# EAGLE schematic Schaltplan final (EAGLE 9.7.0)
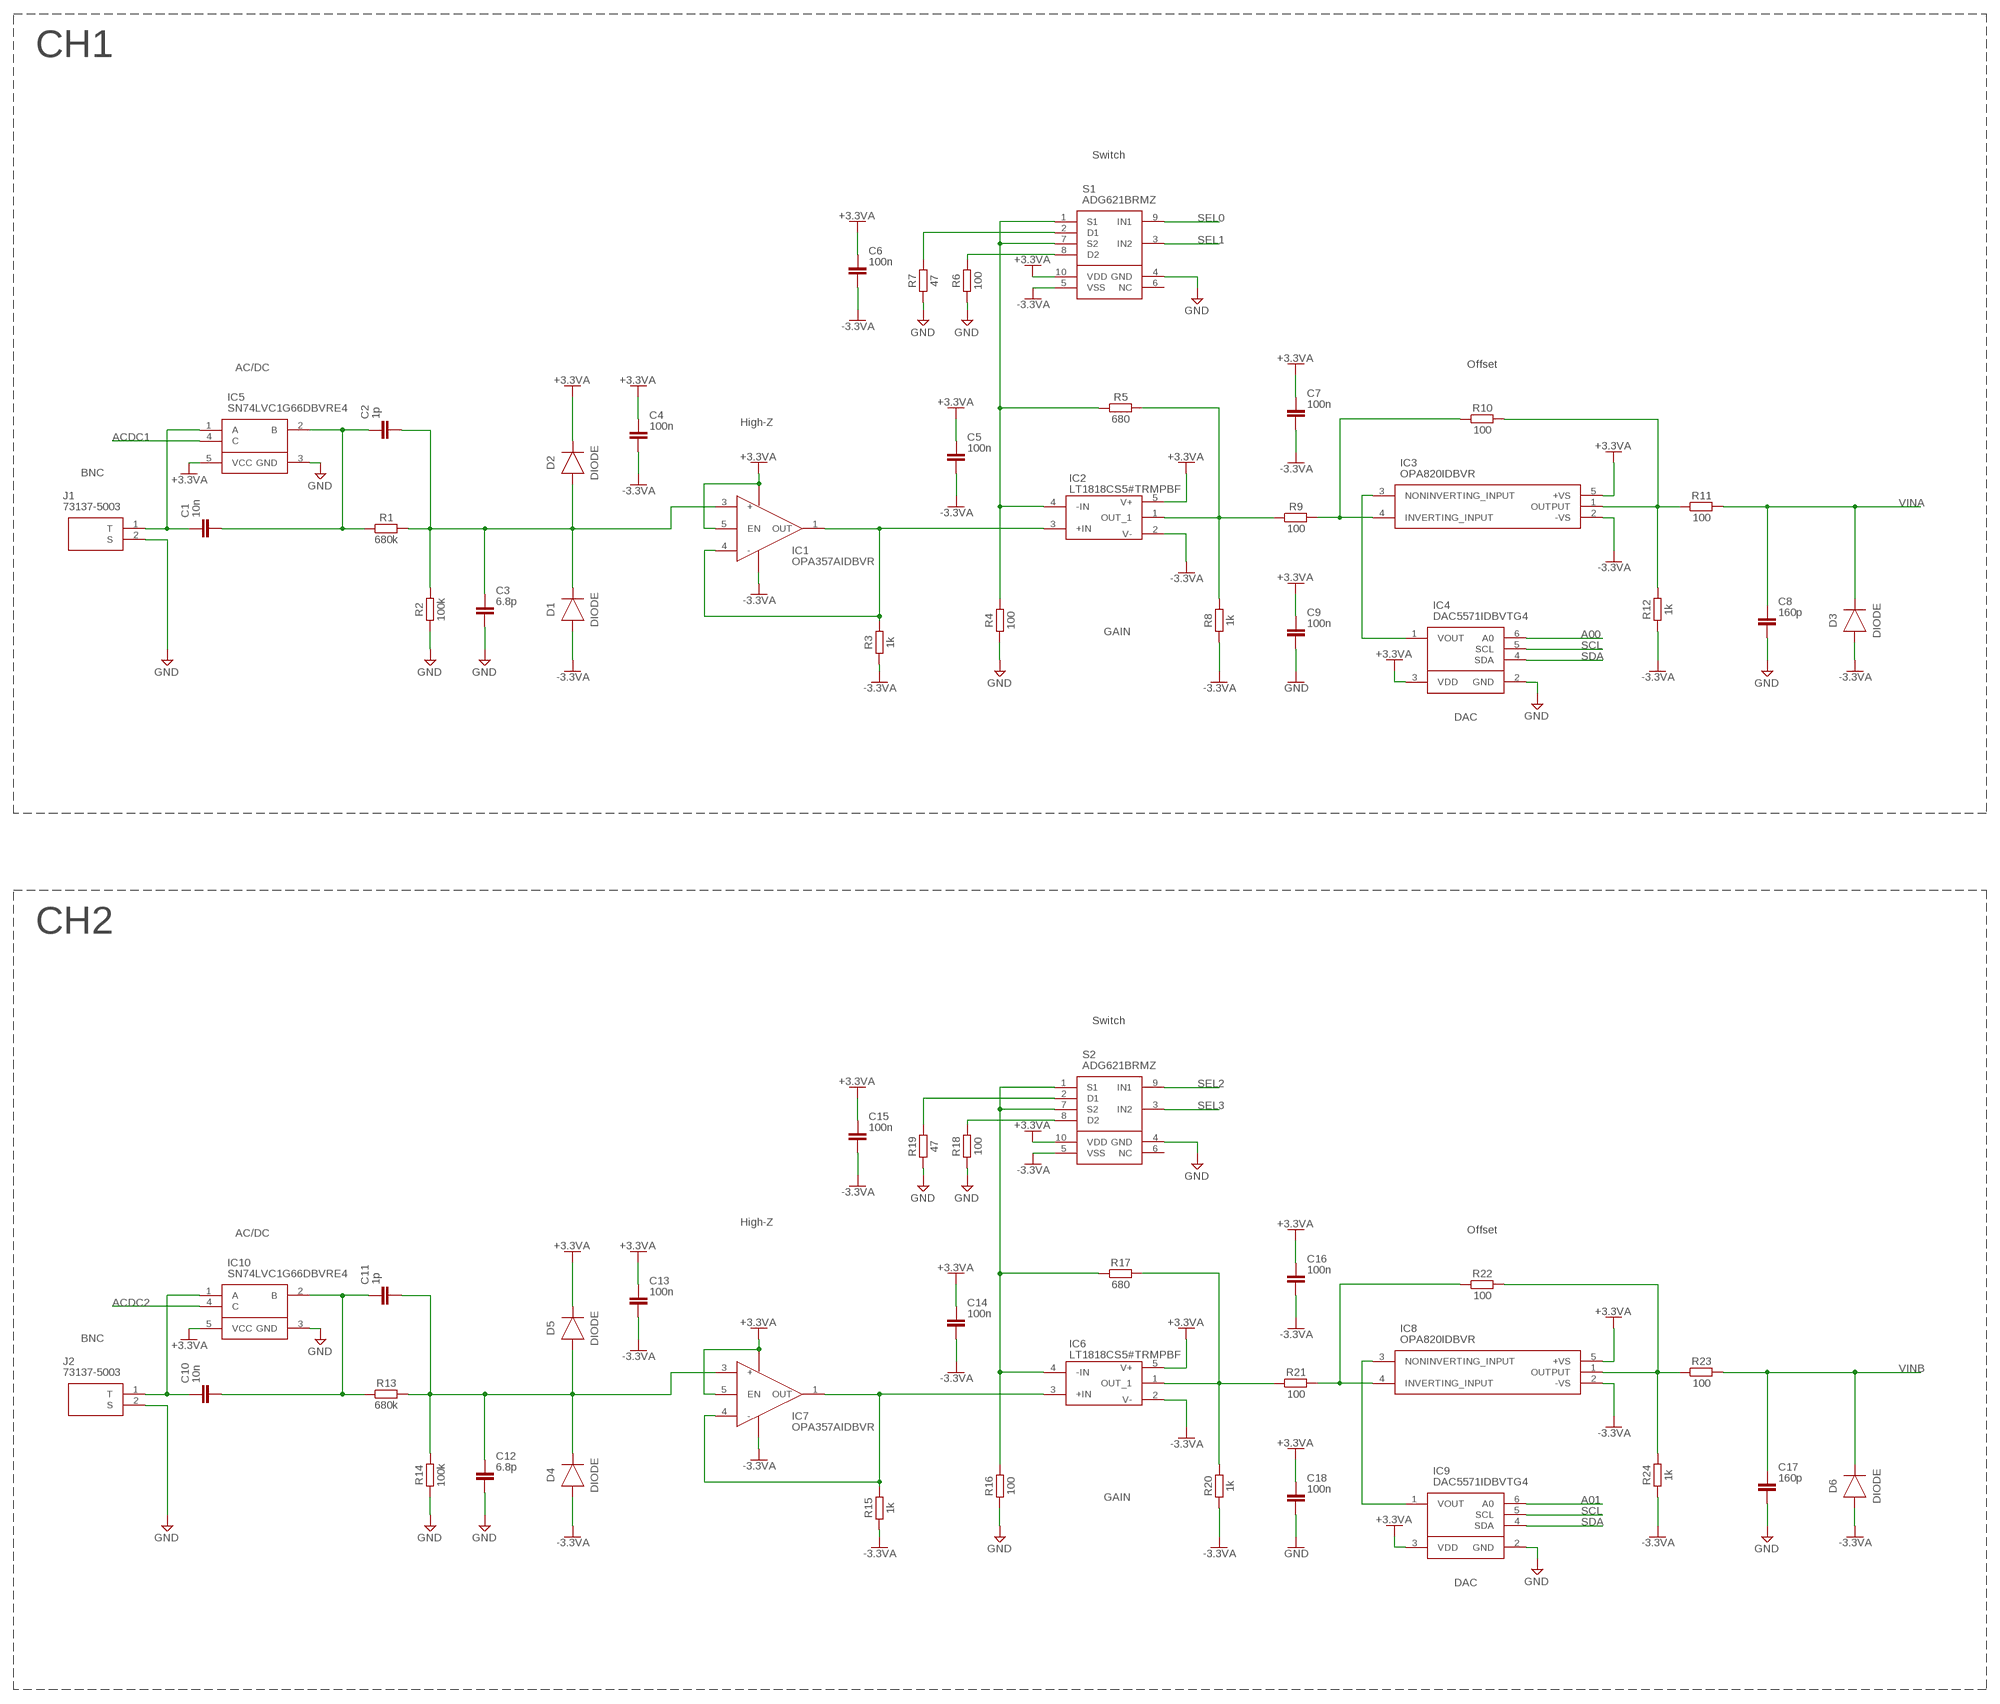
[diagram p0: schematic, sheet 1, part 1 of 2]
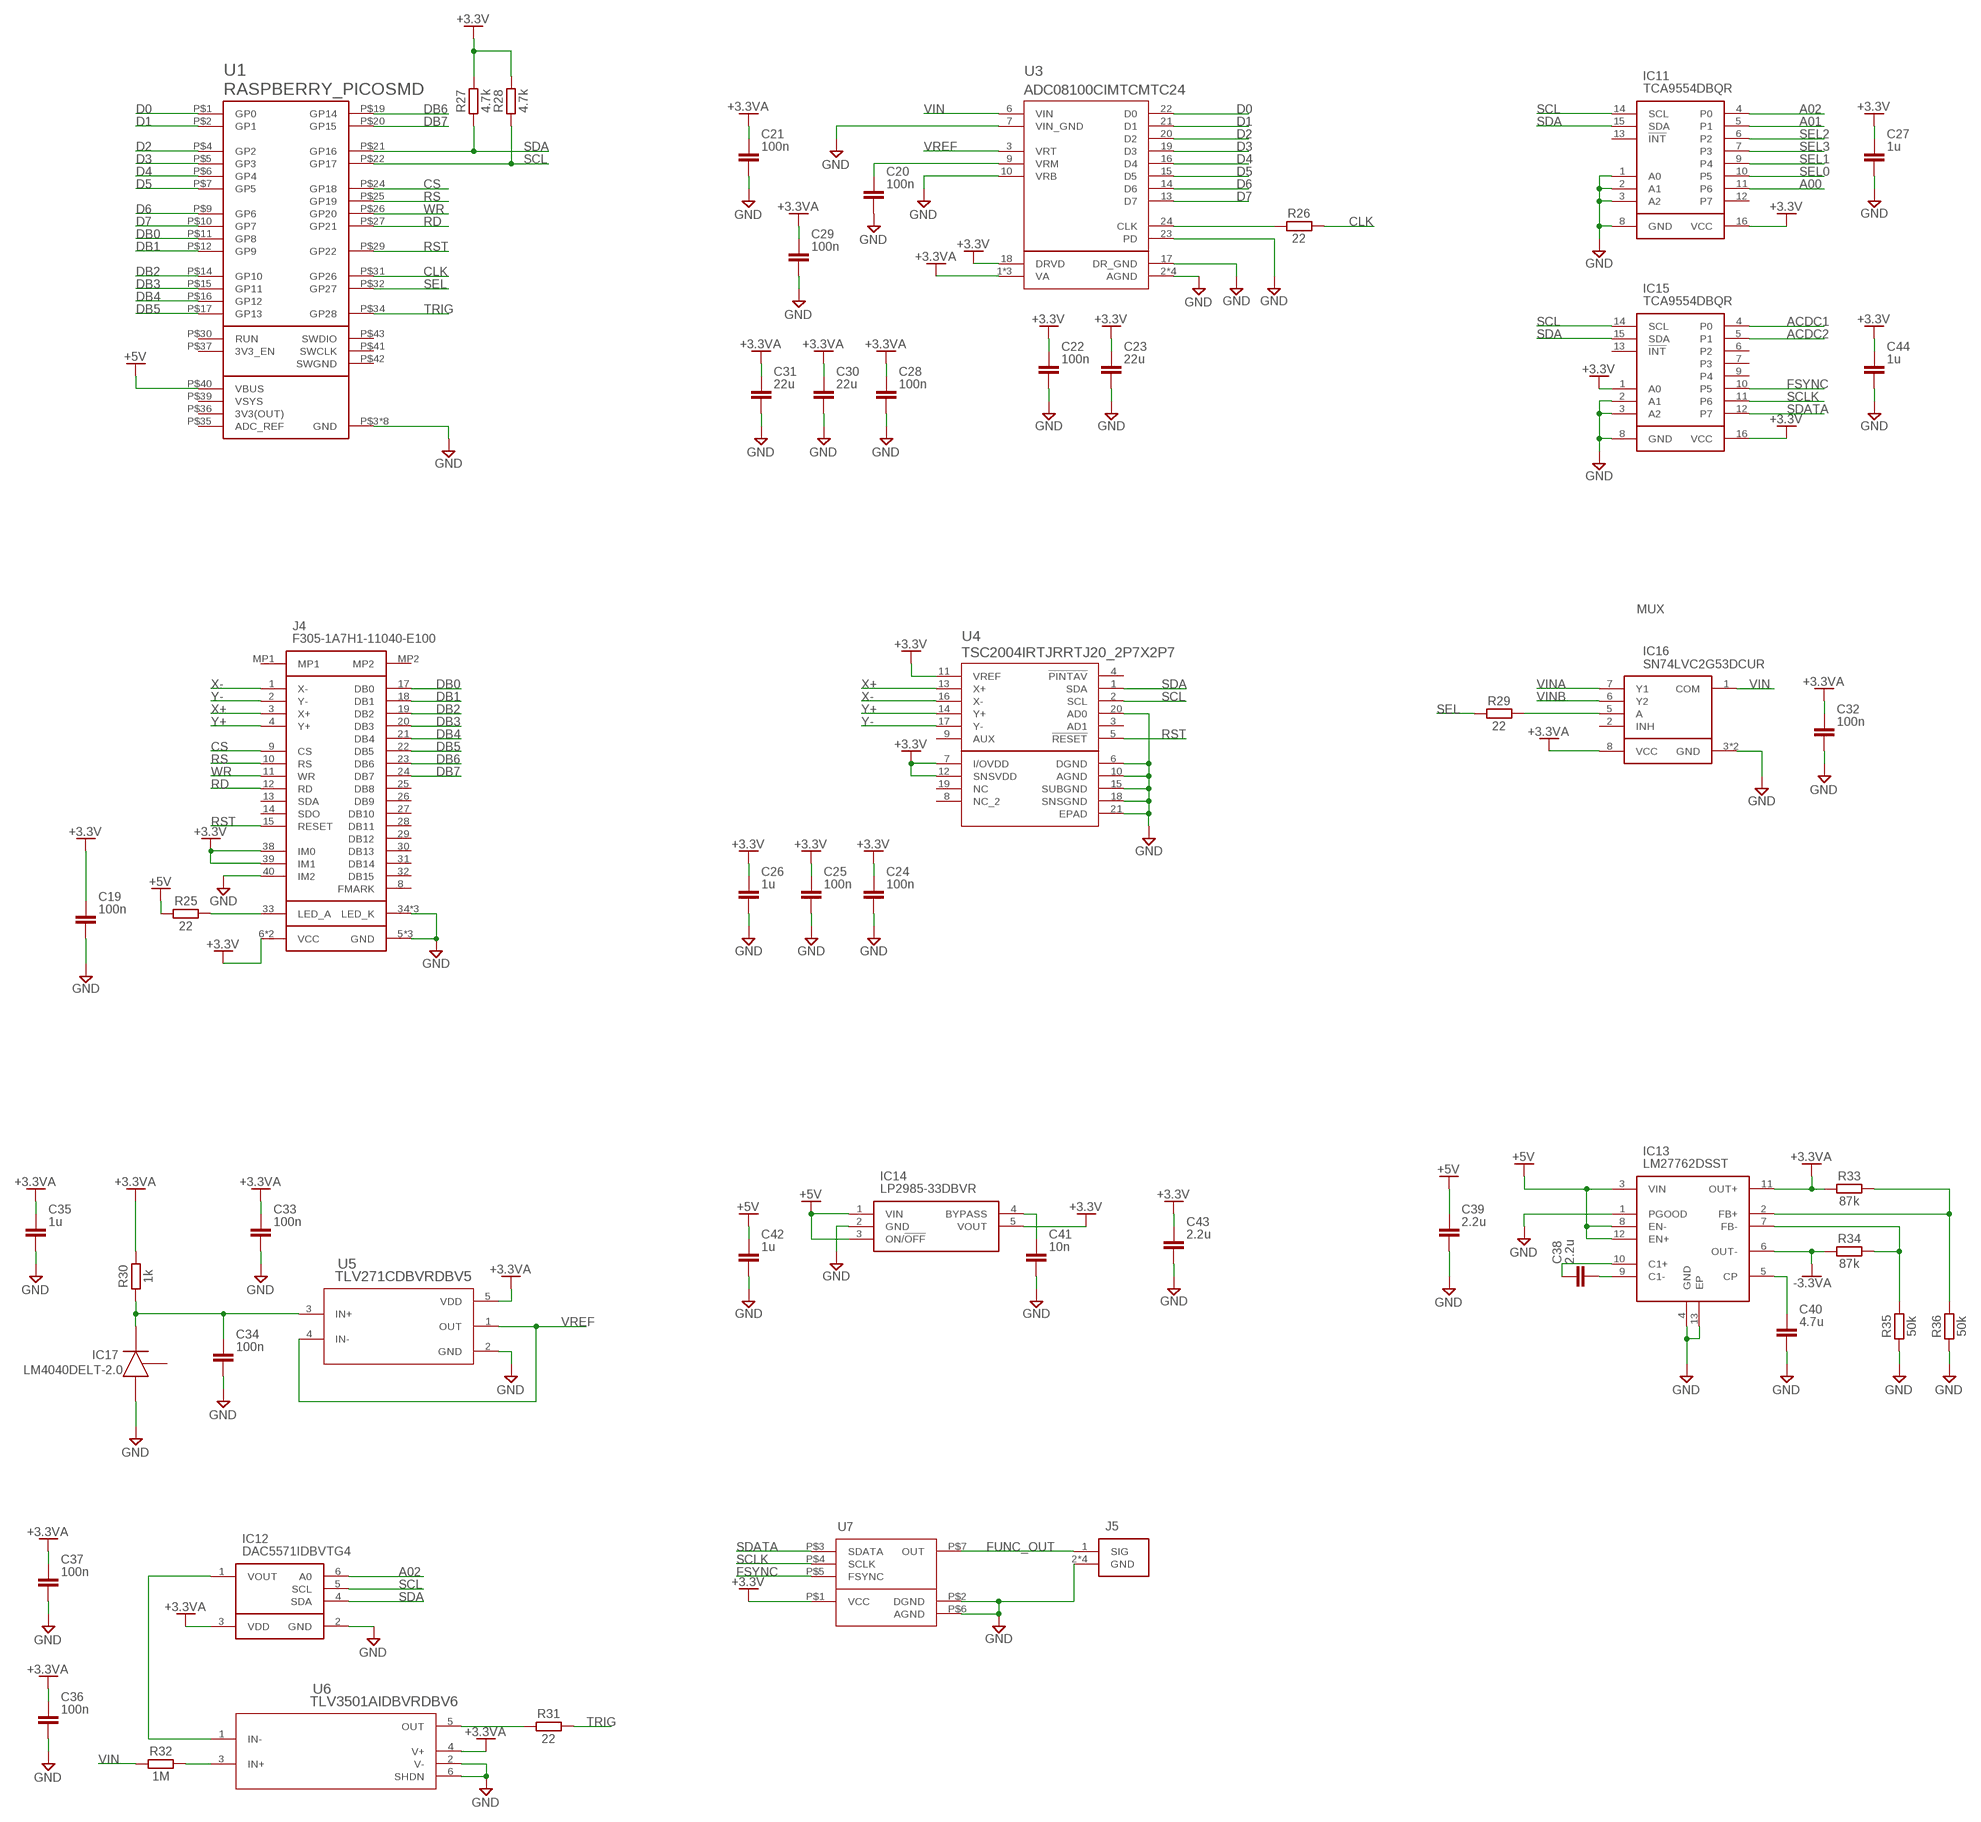
[diagram p1: schematic, sheet 1, part 2 of 2]

## Parts
C1  10n  C_CHIP-0805(2012-METRIC)  [CAPC2012X110]
C2  1p  C_CHIP-0805(2012-METRIC)  [CAPC2012X110]
C3  6.8p  C_CHIP-0805(2012-METRIC)  [CAPC2012X110]
C4  100n  C_CHIP-0805(2012-METRIC)  [CAPC2012X110]
C5  100n  C_CHIP-0805(2012-METRIC)  [CAPC2012X110]
C6  100n  C_CHIP-0805(2012-METRIC)  [CAPC2012X110]
C7  100n  C_CHIP-0805(2012-METRIC)  [CAPC2012X110]
C8  160p  C_CHIP-0805(2012-METRIC)  [CAPC2012X110]
C9  100n  C_CHIP-0805(2012-METRIC)  [CAPC2012X110]
C10  10n  C_CHIP-0805(2012-METRIC)  [CAPC2012X110]
C11  1p  C_CHIP-0805(2012-METRIC)  [CAPC2012X110]
C12  6.8p  C_CHIP-0805(2012-METRIC)  [CAPC2012X110]
C13  100n  C_CHIP-0805(2012-METRIC)  [CAPC2012X110]
C14  100n  C_CHIP-0805(2012-METRIC)  [CAPC2012X110]
C15  100n  C_CHIP-0805(2012-METRIC)  [CAPC2012X110]
C16  100n  C_CHIP-0805(2012-METRIC)  [CAPC2012X110]
C17  160p  C_CHIP-0805(2012-METRIC)  [CAPC2012X110]
C18  100n  C_CHIP-0805(2012-METRIC)  [CAPC2012X110]
C19  100n  C_CHIP-0805(2012-METRIC)  [CAPC2012X110]
C20  100n  C_CHIP-0805(2012-METRIC)  [CAPC2012X110]
C21  100n  C_CHIP-0805(2012-METRIC)  [CAPC2012X110]
C22  100n  C_CHIP-0805(2012-METRIC)  [CAPC2012X110]
C23  22u  C_CHIP-0805(2012-METRIC)  [CAPC2012X110]
C24  100n  C_CHIP-0805(2012-METRIC)  [CAPC2012X110]
C25  100n  C_CHIP-0805(2012-METRIC)  [CAPC2012X110]
C26  1u  C_CHIP-0805(2012-METRIC)  [CAPC2012X110]
C27  1u  C_CHIP-0805(2012-METRIC)  [CAPC2012X110]
C28  100n  C_CHIP-0805(2012-METRIC)  [CAPC2012X110]
C29  100n  C_CHIP-0805(2012-METRIC)  [CAPC2012X110]
C30  22u  C_CHIP-0805(2012-METRIC)  [CAPC2012X110]
C31  22u  C_CHIP-0805(2012-METRIC)  [CAPC2012X110]
C32  100n  C_CHIP-0805(2012-METRIC)  [CAPC2012X110]
C33  100n  C_CHIP-0805(2012-METRIC)  [CAPC2012X110]
C34  100n  C_CHIP-0805(2012-METRIC)  [CAPC2012X110]
C35  1u  C_CHIP-0805(2012-METRIC)  [CAPC2012X110]
C36  100n  C_CHIP-0805(2012-METRIC)  [CAPC2012X110]
C37  100n  C_CHIP-0805(2012-METRIC)  [CAPC2012X110]
C38  2.2u  C_CHIP-0805(2012-METRIC)  [CAPC2012X110]
C39  2.2u  C_CHIP-0805(2012-METRIC)  [CAPC2012X110]
C40  4.7u  C_CHIP-0805(2012-METRIC)  [CAPC2012X110]
C41  10n  C_CHIP-0805(2012-METRIC)  [CAPC2012X110]
C42  1u  C_CHIP-0805(2012-METRIC)  [CAPC2012X110]
C43  2.2u  C_CHIP-0805(2012-METRIC)  [CAPC2012X110]
C44  1u  C_CHIP-0805(2012-METRIC)  [CAPC2012X110]
D1  DIODE  DIODE_DO-219-AC(SOD323F)  [SODFL2513X70]
D2  DIODE  DIODE_DO-219-AC(SOD323F)  [SODFL2513X70]
D3  DIODE  DIODE_DO-219-AC(SOD323F)  [SODFL2513X70]
D4  DIODE  DIODE_DO-219-AC(SOD323F)  [SODFL2513X70]
D5  DIODE  DIODE_DO-219-AC(SOD323F)  [SODFL2513X70]
D6  DIODE  DIODE_DO-219-AC(SOD323F)  [SODFL2513X70]
IC1  OPA357AIDBVR  [SOT95P280X145-6N]
IC2  LT1818CS5#TRMPBF  [SOT95P280X100-5N]
IC3  OPA820IDBVR  [SOT95P280X145-5N]
IC4  DAC5571IDBVTG4  [SOT95P280X145-6N]
IC5  SN74LVC1G66DBVRE4  [SOT95P280X145-5N]
IC6  LT1818CS5#TRMPBF  [SOT95P280X100-5N]
IC7  OPA357AIDBVR  [SOT95P280X145-6N]
IC8  OPA820IDBVR  [SOT95P280X145-5N]
IC9  DAC5571IDBVTG4  [SOT95P280X145-6N]
IC10  SN74LVC1G66DBVRE4  [SOT95P280X145-5N]
IC11  TCA9554DBQR  [SOP64P600X175-16N]
IC12  DAC5571IDBVTG4  [SOT95P280X145-6N]
IC13  LM27762DSST  [SON50P200X300X80-13N]
IC14  LP2985-33DBVR  [SOT95P280X145-5N]
IC15  TCA9554DBQR  [SOP64P600X175-16N]
IC16  SN74LVC2G53DCUR  [SOP50P310X90-8N]
IC17  LM4040DELT-2.0  [SOT65P210X110-3N]
J1  73137-5003  [731375003]
J2  73137-5003  [731375003]
J4  F305-1A7H1-11040-E100  [F3051A7H111040E100]
J5  PCB.SMAFRA.HT  [PCBSMAFRAHT]
R1  680k  R_CHIP-0805(2012-METRIC)  [RESC2012X65]
R2  100k  R_CHIP-0805(2012-METRIC)  [RESC2012X65]
R3  1k  R_CHIP-0805(2012-METRIC)  [RESC2012X65]
R4  100  R_CHIP-0805(2012-METRIC)  [RESC2012X65]
R5  680  R_CHIP-0805(2012-METRIC)  [RESC2012X65]
R6  100  R_CHIP-0805(2012-METRIC)  [RESC2012X65]
R7  47  R_CHIP-0805(2012-METRIC)  [RESC2012X65]
R8  1k  R_CHIP-0805(2012-METRIC)  [RESC2012X65]
R9  100  R_CHIP-0805(2012-METRIC)  [RESC2012X65]
R10  100  R_CHIP-0805(2012-METRIC)  [RESC2012X65]
R11  100  R_CHIP-0805(2012-METRIC)  [RESC2012X65]
R12  1k  R_CHIP-0805(2012-METRIC)  [RESC2012X65]
R13  680k  R_CHIP-0805(2012-METRIC)  [RESC2012X65]
R14  100k  R_CHIP-0805(2012-METRIC)  [RESC2012X65]
R15  1k  R_CHIP-0805(2012-METRIC)  [RESC2012X65]
R16  100  R_CHIP-0805(2012-METRIC)  [RESC2012X65]
R17  680  R_CHIP-0805(2012-METRIC)  [RESC2012X65]
R18  100  R_CHIP-0805(2012-METRIC)  [RESC2012X65]
R19  47  R_CHIP-0805(2012-METRIC)  [RESC2012X65]
R20  1k  R_CHIP-0805(2012-METRIC)  [RESC2012X65]
R21  100  R_CHIP-0805(2012-METRIC)  [RESC2012X65]
R22  100  R_CHIP-0805(2012-METRIC)  [RESC2012X65]
R23  100  R_CHIP-0805(2012-METRIC)  [RESC2012X65]
R24  1k  R_CHIP-0805(2012-METRIC)  [RESC2012X65]
R25  22  R_CHIP-0805(2012-METRIC)  [RESC2012X65]
R26  22  R_CHIP-0805(2012-METRIC)  [RESC2012X65]
R27  4.7k  R_CHIP-0805(2012-METRIC)  [RESC2012X65]
R28  4.7k  R_CHIP-0805(2012-METRIC)  [RESC2012X65]
R29  22  R_CHIP-0805(2012-METRIC)  [RESC2012X65]
R30  1k  R_CHIP-0805(2012-METRIC)  [RESC2012X65]
R31  22  R_CHIP-0805(2012-METRIC)  [RESC2012X65]
R32  1M  R_CHIP-0805(2012-METRIC)  [RESC2012X65]
R33  87k  R_CHIP-0805(2012-METRIC)  [RESC2012X65]
R34  87k  R_CHIP-0805(2012-METRIC)  [RESC2012X65]
R35  50k  R_CHIP-0805(2012-METRIC)  [RESC2012X65]
R36  50k  R_CHIP-0805(2012-METRIC)  [RESC2012X65]
S1  ADG621BRMZ  [SOP50P490X110-10N]
S2  ADG621BRMZ  [SOP50P490X110-10N]
U1  RASPBERRY_PICOSMD  [PICO-PKG-SMD]
U3  ADC08100CIMTCMTC24  [MTC24]
U4  TSC2004IRTJRRTJ20_2P7X2P7  [RTJ20_2P7X2P7]
U5  TLV271CDBVRDBV5  [DBV5]
U6  TLV3501AIDBVRDBV6  [DBV6]
U7  AD9833FUNCGEN  [AD9833FUNCGEN]

## Nets
+3.3V: C19.1 C22.1 C23.1 C24.1 C25.1 C26.1 C27.1 C43.1 C44.1 IC11.16(VCC) IC14.5(VOUT) IC15.1(A0) IC15.16(VCC) J4.6(VCC) J4.7(VCC) J4.38(IM0) J4.39(IM1) R27.2 R28.2 U3.18(DRVD) U4.7(I/OVDD) U4.11(VREF) U4.12(SNSVDD) U7.P$1(VCC)
+3.3VA: C4.1 C5.1 C6.1 C7.1 C9.1 C13.1 C14.1 C15.1 C16.1 C18.1 C21.1 C28.1 C29.1 C30.1 C31.1 C32.1 C33.1 C35.1 C36.1 C37.1 D2.1(C) D5.1(C) IC1.5(EN) IC1.6(V+) IC2.5(V+) IC3.5(+VS) IC4.3(VDD) IC5.5(VCC) IC6.5(V+) IC7.5(EN) IC7.6(V+) IC8.5(+VS) IC9.3(VDD) IC10.5(VCC) IC12.3(VDD) IC13.11(OUT+) IC16.8(VCC) R30.2 R33.1 S1.10(VDD) S2.10(VDD) U3.1(VA) U3.4(VA) U3.12(VA) U5.5(VDD) U6.4(V+)
+3.3VA1: C34.1 IC17.1(K) R30.1 U5.3(IN+)
+5V: C39.1 C42.1 IC13.3(VIN) IC13.8(EN-) IC13.12(EN+) IC14.1(VIN) IC14.3(ON/!OFF) R25.1 U1.P$40(VBUS)
-3.3VA: C4.2 C5.2 C6.2 C7.2 C13.2 C14.2 C15.2 C16.2 D1.2(A) D3.2(A) D4.2(A) D6.2(A) IC1.2(V-) IC2.2(V-) IC3.2(-VS) IC6.2(V-) IC7.2(V-) IC8.2(-VS) IC13.6(OUT-) R3.1 R8.1 R12.1 R15.1 R20.1 R24.1 R34.1 S1.5(VSS) S2.5(VSS)
A00: IC4.6(A0) IC11.11(P6)
A01: IC9.6(A0) IC11.5(P1)
A02: IC11.4(P0) IC12.6(A0)
ACDC1: IC5.4(C) IC15.4(P0)
ACDC2: IC10.4(C) IC15.5(P1)
CLK: R26.2 U1.P$31(GP26)
CS: J4.9(CS) U1.P$24(GP18)
D0: U1.P$1(GP0) U3.22(D0)
D1: U1.P$2(GP1) U3.21(D1)
D2: U1.P$4(GP2) U3.20(D2)
D3: U1.P$5(GP3) U3.19(D3)
D4: U1.P$6(GP4) U3.16(D4)
D5: U1.P$7(GP5) U3.15(D5)
D6: U1.P$9(GP6) U3.14(D6)
D7: U1.P$10(GP7) U3.13(D7)
DB0: J4.17(DB0) U1.P$11(GP8)
DB1: J4.18(DB1) U1.P$12(GP9)
DB2: J4.19(DB2) U1.P$14(GP10)
DB3: J4.20(DB3) U1.P$15(GP11)
DB4: J4.21(DB4) U1.P$16(GP12)
DB5: J4.22(DB5) U1.P$17(GP13)
DB6: J4.23(DB6) U1.P$19(GP14)
DB7: J4.24(DB7) U1.P$20(GP15)
FSYNC: IC15.10(P5) U7.P$5(FSYNC)
FUNC_OUT: J5.1(SIG) U7.P$7(OUT)
GND: C3.2 C8.2 C9.2 C12.2 C17.2 C18.2 C19.2 C20.2 C21.2 C22.2 C23.2 C24.2 C25.2 C26.2 C27.2 C28.2 C29.2 C30.2 C31.2 C32.2 C33.2 C34.2 C35.2 C36.2 C37.2 C39.2 C40.2 C41.2 C42.2 C43.2 C44.2 IC4.2(GND) IC5.3(GND) IC9.2(GND) IC10.3(GND) IC11.1(A0) IC11.2(A1) IC11.3(A2) IC11.8(GND) IC12.2(GND) IC13.1(PGOOD) IC13.4(GND) IC13.13(EP) IC14.2(GND) IC15.2(A1) IC15.3(A2) IC15.8(GND) IC16.3(GND) IC16.4(GND) IC17.2(A) J1.2(S) J2.2(S) J4.5(GND) J4.16(GND) J4.34(LED_K) J4.35(LED_K) J4.36(LED_K) J4.37(GND) J4.40(IM2) J5.2(GND) J5.3(GND) J5.4(GND) J5.5(GND) R2.1 R4.1 R6.1 R7.1 R14.1 R16.1 R18.1 R19.1 R35.1 R36.1 S1.4(GND) S2.4(GND) U1.P$3(GND) U1.P$8(GND) U1.P$13(GND) U1.P$18(GND) U1.P$23(GND) U1.P$28(GND) U1.P$33(GND) U1.P$38(GND) U3.2(AGND) U3.5(AGND) U3.7(VIN_GND) U3.8(AGND) U3.10(VRB) U3.11(AGND) U3.17(DR_GND) U3.23(PD) U4.6(DGND) U4.10(AGND) U4.15(SUBGND) U4.18(SNSGND) U4.20(AD0) U4.21(EPAD) U5.2(GND) U6.2(V-) U6.6(SHDN) U7.P$2(DGND) U7.P$6(AGND)
N$1: C1.1 IC5.1(A) J1.1(T)
N$2: C1.2 C2.1 IC5.2(B) R1.1
N$3: C2.2 C3.1 D1.1(C) D2.2(A) IC1.3(+) R1.2 R2.2
N$4: R7.2 S1.2(D1)
N$5: IC2.4(-IN) R4.2 R5.1 S1.1(S1) S1.7(S2)
N$6: IC2.1(OUT_1) R5.2 R8.2 R9.1
N$7: IC1.1(OUT) IC1.4(-) IC2.3(+IN) R3.2
N$8: R6.2 S1.8(D2)
N$9: IC3.4(INVERTING_INPUT) R9.2 R10.1
N$10: IC3.1(OUTPUT) R10.2 R11.1 R12.2
N$11: IC3.3(NONINVERTING_INPUT) IC4.1(VOUT)
N$12: C10.1 IC10.1(A) J2.1(T)
N$13: C10.2 C11.1 IC10.2(B) R13.1
N$14: C11.2 C12.1 D4.1(C) D5.2(A) IC7.3(+) R13.2 R14.2
N$15: IC6.4(-IN) R16.2 R17.1 S2.1(S1) S2.7(S2)
N$16: IC6.1(OUT_1) R17.2 R20.2 R21.1
N$17: IC6.3(+IN) IC7.1(OUT) IC7.4(-) R15.2
N$18: R19.2 S2.2(D1)
N$19: R18.2 S2.8(D2)
N$20: IC8.4(INVERTING_INPUT) R21.2 R22.1
N$21: IC8.1(OUTPUT) R22.2 R23.1 R24.2
N$22: IC8.3(NONINVERTING_INPUT) IC9.1(VOUT)
N$23: R31.1 U6.5(OUT)
N$24: R32.2 U6.3(IN+)
N$25: IC12.1(VOUT) U6.1(IN-)
N$26: C20.1 U3.9(VRM)
N$27: J4.33(LED_A) R25.2
N$28: C40.1 IC13.5(CP)
N$29: IC13.2(FB+) R33.2 R36.2
N$30: C41.1 IC14.4(BYPASS)
N$31: IC13.7(FB-) R34.2 R35.2
N$32: C38.1 IC13.10(C1+)
N$33: C38.2 IC13.9(C1-)
N$37: IC16.5(A) R29.2
N$39: R26.1 U3.24(CLK)
RD: J4.12(RD) U1.P$27(GP21)
RS: J4.10(RS) U1.P$25(GP19)
RST: J4.15(RESET) U1.P$29(GP22) U4.5(!RESET)
SCL: IC4.5(SCL) IC9.5(SCL) IC11.14(SCL) IC12.5(SCL) IC15.14(SCL) R28.1 U1.P$22(GP17) U4.2(SCL)
SCLK: IC15.11(P6) U7.P$4(SCLK)
SDA: IC4.4(SDA) IC9.4(SDA) IC11.15(SDA) IC12.4(SDA) IC15.15(SDA) R27.1 U1.P$21(GP16) U4.1(SDA)
SDATA: IC15.12(P7) U7.P$3(SDATA)
SEL: R29.1 U1.P$32(GP27)
SEL0: IC11.10(P5) S1.9(IN1)
SEL1: IC11.9(P4) S1.3(IN2)
SEL2: IC11.6(P2) S2.9(IN1)
SEL3: IC11.7(P3) S2.3(IN2)
TRIG: R31.2 U1.P$34(GP28)
VIN: IC16.1(COM) R32.1 U3.6(VIN)
VINA: C8.1 D3.1(C) IC16.7(Y1) R11.2
VINB: C17.1 D6.1(C) IC16.6(Y2) R23.2
VREF: U3.3(VRT) U5.1(OUT) U5.4(IN-)
WR: J4.11(WR) U1.P$26(GP20)
X+: J4.3(X+) U4.13(X+)
X-: J4.1(X-) U4.16(X-)
Y+: J4.4(Y+) U4.14(Y+)
Y-: J4.2(Y-) U4.17(Y-)
Unconnected: IC11.12(P7) IC11.13(!INT) IC15.6(P2) IC15.7(P3) IC15.9(P4) IC15.13(!INT) IC16.2(INH) IC17.3(NC) J1.P$1(MH) J1.P$2(MH) J2.P$1(MH) J2.P$2(MH) J4.8(FMARK) J4.13(SDA) J4.14(SDO) J4.25(DB8) J4.26(DB9) J4.27(DB10) J4.28(DB11) J4.29(DB12) J4.30(DB13) J4.31(DB14) J4.32(DB15) J4.MP1 J4.MP2 S1.6(NC) S2.6(NC) U1.P$30(RUN) U1.P$35(ADC_REF) U1.P$37(3V3_EN) U1.P$41(SWCLK) U1.P$43(SWDIO) U4.3(AD1) U4.4(!PINTAV) U4.8(NC_2) U4.9(AUX) U4.19(NC)

## Notes on the sheet
- CH1
- Switch
- Offset
- AC/DC
- High-Z
- BNC | MUX
- GAIN
- DAC
- CH2
- Switch
- High-Z
- Offset
- AC/DC
- BNC
- GAIN
- DAC

## Power pins joined to a net without a drawn wire
3V3(OUT): U1.P$36(3V3(OUT))
SWGND: U1.P$42(SWGND)
VSYS: U1.P$39(VSYS)

## Library data of the parts
C1-C44 = Capacitor:C: Capacitor - Generic; CATEGORY: Capacitor
D1-D6 = Diode:DIODE: Diode Rectifier - Generic; CATEGORY: Diode; SUB-CATEGORY: Rectifier
IC1 IC7 = Bibliothek:OPA357AIDBVR: Texas Instruments OPA300AIDBVT Op Amp, 150MHz CMOS, Rail to Rail, 3 V, 5 V, 6-Pin SOT-23 Source: Datasheet <http://www.ti.com/lit/gpn/opa300>; ARROW_PART_NUMBER: OPA300AIDBVT; ARROW_PRICE-STOCK: https://www.arrow.com/en/products/opa300aidbvt/texas-instruments; DESCRIPTION: Texas Instruments OPA300AIDBVT Op Amp, 150MHz CMOS, Rail to Rail, 3 V, 5 V, 6-Pin SOT-23; HEIGHT: 1.45mm; MANUFACTURER_NAME: Texas Instruments; MANUFACTURER_PART_NUMBER: OPA300AIDBVT; MOUSER_PART_NUMBER: 595-OPA300AIDBVT; MOUSER_PRICE-STOCK: https://www.mouser.co.uk/ProductDetail/Texas-Instruments/OPA300AIDBVT?qs=7nS3%252BbEUL6t1esg%2FG6ny6A%3D%3D
IC2 IC6 = Bibliothek:LT1818CS5#TRMPBF: OP Amp Single Volt Fdbk +/-6.3V/12.6V Automotive 5-Pin TSOT-23 T/R Source: Datasheet <https://www.analog.com/media/en/technical-documentation/data-sheets/18189fb.pdf>; DESCRIPTION: OP Amp Single Volt Fdbk +/-6.3V/12.6V Automotive 5-Pin TSOT-23 T/R; HEIGHT: 1mm; MANUFACTURER_NAME: Analog Devices; MANUFACTURER_PART_NUMBER: LT1818CS5#TRMPBF; MOUSER_PART_NUMBER: 584-LT1818CS5#TRMPBF; MOUSER_PRICE-STOCK: https://www.mouser.co.uk/ProductDetail/Analog-Devices/LT1818CS5TRMPBF?qs=ytflclh7QUVAYHHwzaOLfQ%3D%3D
IC3 IC8 = Bibliothek:OPA820IDBVR: Unity Gain Stable,Low Noise,Voltage Feedback Operational Amplifier Source: Datasheet <http://www.ti.com/lit/gpn/OPA820>; ARROW_PART_NUMBER: OPA820IDBVR; ARROW_PRICE-STOCK: https://www.arrow.com/en/products/opa820idbvr/texas-instruments?region=nac; DESCRIPTION: Unity Gain Stable,Low Noise,Voltage Feedback Operational Amplifier; HEIGHT: 1.45mm; MANUFACTURER_NAME: Texas Instruments; MANUFACTURER_PART_NUMBER: OPA820IDBVR; MOUSER_PART_NUMBER: 595-OPA820IDBVR; MOUSER_PRICE-STOCK: https://www.mouser.co.uk/ProductDetail/Texas-Instruments/OPA820IDBVR?qs=wgAEGBTxy7nJk6xHGNzl%2Fw%3D%3D
IC4 IC9 IC12 = Bibliothek:DAC5571IDBVTG4: Digital to Analog Converters - DAC Low-power 8-Bit w/hi-speed I2C Input Source: Datasheet <https://www.ti.com/lit/ds/symlink/dac5571.pdf>; ARROW_PART_NUMBER: DAC5571IDBVTG4; ARROW_PRICE-STOCK: https://www.arrow.com/en/products/dac5571idbvtg4/texas-instruments; DESCRIPTION: Digital to Analog Converters - DAC Low-power 8-Bit w/hi-speed I2C Input; HEIGHT: 1.45mm; MANUFACTURER_NAME: Texas Instruments; MANUFACTURER_PART_NUMBER: DAC5571IDBVTG4; MOUSER_PART_NUMBER: 595-DAC5571IDBVTG4; MOUSER_PRICE-STOCK: https://www.mouser.co.uk/ProductDetail/Texas-Instruments/DAC5571IDBVTG4?qs=vul0MlC%2Fa1dIXBAlKeMYTQ%3D%3D
IC5 IC10 = Bibliothek:SN74LVC1G66DBVRE4: Analogue Switch ICs Single Bilateral Analog Switch Source: Datasheet <http://www.ti.com/general/docs/suppproductinfo.tsp?distId=26&gotoUrl=http://www.ti.com/lit/gpn/sn74lvc1g66>; ARROW_PART_NUMBER: SN74LVC1G66DBVRE4; ARROW_PRICE-STOCK: https://www.arrow.com/en/products/sn74lvc1g66dbvre4/texas-instruments; DESCRIPTION: Analogue Switch ICs Single Bilateral Analog Switch; HEIGHT: 1.45mm; MANUFACTURER_NAME: Texas Instruments; MANUFACTURER_PART_NUMBER: SN74LVC1G66DBVRE4; MOUSER_PART_NUMBER: 595-SN74LVC1G66DBVRE; MOUSER_PRICE-STOCK: https://www.mouser.co.uk/ProductDetail/Texas-Instruments/SN74LVC1G66DBVRE4?qs=PVVDbbWpW3KpmpL0QtM70g%3D%3D
IC11 IC15 = Bibliothek:TCA9554DBQR: Remote 8-Bit I2C and SMBus I/O Expander Source: Datasheet <http://www.ti.com/lit/gpn/tca9554>; DESCRIPTION: Remote 8-Bit I2C and SMBus I/O Expander; HEIGHT: 1.75mm; MANUFACTURER_NAME: Texas Instruments; MANUFACTURER_PART_NUMBER: TCA9554DBQR; MOUSER_PART_NUMBER: 595-TCA9554DBQR; MOUSER_PRICE-STOCK: https://www.mouser.co.uk/ProductDetail/Texas-Instruments/TCA9554DBQR?qs=MiqG6Kq1qKNgK3BiZWWJgA%3D%3D
IC13 = Bibliothek:LM27762DSST: Low-Noise Positive- and Negative-Output Charge Pump With Integrated LDO Source: Datasheet <http://www.ti.com/lit/ds/symlink/lm27762.pdf>; ARROW_PART_NUMBER: LM27762DSST; ARROW_PRICE-STOCK: https://www.arrow.com/en/products/lm27762dsst/texas-instruments?region=nac; DESCRIPTION: Low-Noise Positive- and Negative-Output Charge Pump With Integrated LDO; HEIGHT: 0.8mm; MANUFACTURER_NAME: Texas Instruments; MANUFACTURER_PART_NUMBER: LM27762DSST; MOUSER_PART_NUMBER: 595-LM27762DSST; MOUSER_PRICE-STOCK: https://www.mouser.co.uk/ProductDetail/Texas-Instruments/LM27762DSST?qs=vcbl%252BK4rRlcgKmrBHASI8g%3D%3D
IC14 = LP2985-33DBVR:LP2985-33DBVR: 150-mA Low-noise Low-dropout Regulator With Shutdown Source: Datasheet <http://www.ti.com/lit/gpn/lp2985>; DESCRIPTION: 150-mA Low-noise Low-dropout Regulator With Shutdown; HEIGHT: 1.45mm; MANUFACTURER_NAME: Texas Instruments; MANUFACTURER_PART_NUMBER: LP2985-33DBVR; MOUSER_PART_NUMBER: 595-LP2985-33DBVR; MOUSER_PRICE-STOCK: https://www.mouser.co.uk/ProductDetail/Texas-Instruments/LP2985-33DBVR?qs=paYhMW8qfiswyUdMjD%2FxlQ%3D%3D
IC16 = Bibliothek:SN74LVC2G53DCUR: Single Pole, Double-Throw (SPDT) Analog Switch or 2:1 Analog Multiplexer/Demultiplexer Source: Datasheet <http://www.ti.com/lit/gpn/sn74lvc2g53>; DESCRIPTION: Single Pole, Double-Throw (SPDT) Analog Switch or 2:1 Analog Multiplexer/Demultiplexer; HEIGHT: 0.9mm; MANUFACTURER_NAME: Texas Instruments; MANUFACTURER_PART_NUMBER: SN74LVC2G53DCUR; MOUSER_PART_NUMBER: 595-SN74LVC2G53DCUR; MOUSER_PRICE-STOCK: https://www.mouser.co.uk/ProductDetail/Texas-Instruments/SN74LVC2G53DCUR?qs=B7lSdIxWQklQg3lKHael0g%3D%3D
IC17 = Bibliothek:LM4040DELT-2.0: Precision micropower shunt voltage reference Source: Datasheet <https://www.st.com/resource/en/datasheet/lm4040.pdf>; DESCRIPTION: Precision micropower shunt voltage reference; HEIGHT: 1.1mm; MANUFACTURER_NAME: STMicroelectronics; MANUFACTURER_PART_NUMBER: LM4040DELT-2.0
J1 J2 = Bibliothek:73137-5003: Molex BNC Series Right Angle 50 PCB Mount Bulkhead Fitting BNC Connector, jack, Nickel, Through Hole Termination Source: Datasheet <https://www.molex.com/pdm_docs/sd/731375003_sd.pdf>; DESCRIPTION: Molex BNC Series Right Angle 50 PCB Mount Bulkhead Fitting BNC Connector, jack, Nickel, Through Hole Termination; HEIGHT: 13.2mm; MANUFACTURER_NAME: Molex; MANUFACTURER_PART_NUMBER: 73137-5003; MOUSER_PART_NUMBER: 538-73137-5003; MOUSER_PRICE-STOCK: https://www.mouser.co.uk/ProductDetail/Molex/73137-5003?qs=ldwB34exYZUMRxRXTNcLMQ%3D%3D
J4 = Bibliothek:F305-1A7H1-11040-E100: Flex Connector, 0.50mm Pitch, Height 2.00mm, Right angle, Flip type, 40 position, With MYLAR Source: Datasheet <https://cdn.amphenol-cs.com/media/wysiwyg/files/drawing/f305-1.pdf>; DESCRIPTION: Flex Connector, 0.50mm Pitch, Height 2.00mm, Right angle, Flip type, 40 position, With MYLAR; HEIGHT: 2.2mm; MANUFACTURER_NAME: Amphenol Communications Solutions; MANUFACTURER_PART_NUMBER: F305-1A7H1-11040-E100; MOUSER_PART_NUMBER: 649-F3051A7H111040E1; MOUSER_PRICE-STOCK: https://www.mouser.co.uk/ProductDetail/Amphenol-Aorora/F305-1A7H1-11040-E100?qs=xZ%2FP%252Ba9zWqZ5RVHUctg7AQ%3D%3D
J5 = Bibliothek:PCB.SMAFRA.HT: RF Connectors / Coaxial Connectors SMA RA PCB Mount, Jack, Gold, 50 , Through Hole Pin Source: Datasheet; DESCRIPTION: RF Connectors / Coaxial Connectors SMA RA PCB Mount, Jack, Gold, 50 , Through Hole Pin; HEIGHT: 9mm; MANUFACTURER_NAME: Taoglas; MANUFACTURER_PART_NUMBER: PCB.SMAFRA.HT; MOUSER_PART_NUMBER: 960-PCB.SMAFRA.HT; MOUSER_PRICE-STOCK: https://www.mouser.co.uk/ProductDetail/Taoglas/PCB.SMAFRA.HT?qs=RuW%2Fu%252BNMQmubIFYcN8w5Dw%3D%3D
R1-R36 = Resistor:R: Resistor Fixed - Generic; CATEGORY: Resistor; SUB-CATEGORY: Fixed
S1 S2 = Bibliothek:ADG621BRMZ: ADG621BRMZ, Analogue Switch Dual SPST, 3, 5V, 10-Pin, MSOP Source: Datasheet <http://www.analog.com/static/imported-files/data_sheets/ADG621_622_623.pdf>; DESCRIPTION: ADG621BRMZ, Analogue Switch Dual SPST, 3, 5V, 10-Pin, MSOP; HEIGHT: 1.1mm; MANUFACTURER_NAME: Analog Devices; MANUFACTURER_PART_NUMBER: ADG621BRMZ; MOUSER_PART_NUMBER: 584-ADG621BRMZ; MOUSER_PRICE-STOCK: https://www.mouser.co.uk/ProductDetail/Analog-Devices/ADG621BRMZ?qs=BpaRKvA4VqFq1opwvWkqjQ%3D%3D
U1 = Bibliothek:RASPBERRY_PICO: Raspberry Pi Pico
U3 = Bibliothek:ADC08100CIMTC; COPYRIGHT: Copyright (C) 2023 Ultra Librarian. All rights reserved.; MANUFACTURER_PART_NUMBER: ADC08100CIMTC; MFR_NAME: Texas Instruments; TYPE: ADC08100CIMTC
U4 = Bibliothek:TSC2004IRTJR; COPYRIGHT: Copyright (C) 2023 Ultra Librarian. All rights reserved.; MANUFACTURER_PART_NUMBER: TSC2004IRTJR; MFR_NAME: Texas Instruments
U5 = Bibliothek:TLV271CDBVR; COPYRIGHT: Copyright (C) 2023 Ultra Librarian. All rights reserved.; MANUFACTURER_PART_NUMBER: TLV271CDBVR; MFR_NAME: Texas Instruments
U6 = Bibliothek:TLV3501AIDBVR; COPYRIGHT: Copyright (C) 2023 Ultra Librarian. All rights reserved.; MANUFACTURER_PART_NUMBER: TLV3501AIDBVR; MFR_NAME: Texas Instruments
U7 = Bibliothek:AD9833FUNCGEN